# EAGLE design board_wifi_v1 (EAGLE 9.1.1)
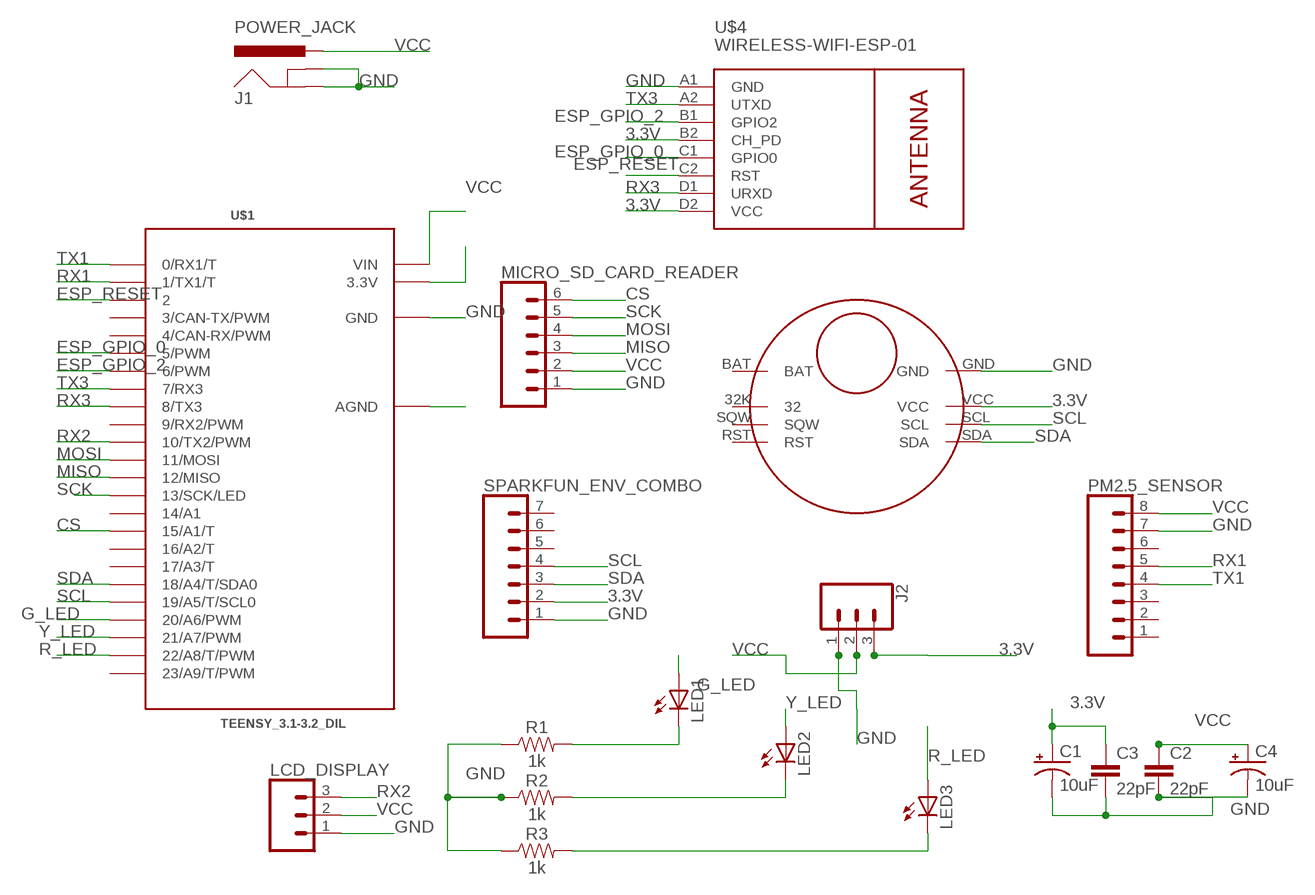
[diagram p0: schematic, sheet 1]

## Parts
C1  10uF  10UF-POLAR-RADIAL-2.5MM-25V-20%  [CPOL-RADIAL-2.5MM-5MM]
C2  22pF  22PF-PTH-2.54MM-200V-5%  [CAP-PTH-2.54]
C3  22pF  22PF-PTH-2.54MM-200V-5%  [CAP-PTH-2.54]
C4  10uF  10UF-POLAR-RADIAL-2.5MM-25V-20%  [CPOL-RADIAL-2.5MM-5MM]
J1  POWER_JACK  [POWER_JACK_PTH]
J2  CONN_03LONGPADS  [1X03_LONGPADS]
LCD_DISPLAY  CONN_031X03_NO_SILK  [1X03_NO_SILK]
LED1  LED3MM  [LED3MM]
LED2  LED3MM  [LED3MM]
LED3  LED3MM  [LED3MM]
MICRO_SD_CARD_READER  CONN_06LONGPADS  [1X06_LONGPADS]
PM2.5_SENSOR  CONN_08NO_SILK_FEMALE_PTH  [1X08_NO_SILK]
R1  1k  1KOHM-HORIZ-1/4W-5%  [AXIAL-0.3]
R2  1k  1KOHM-HORIZ-1/4W-5%  [AXIAL-0.3]
R3  1k  1KOHM-HORIZ-1/4W-5%  [AXIAL-0.3]
SPARKFUN_ENV_COMBO  CONN_07NO_SILK  [1X07_NO_SILK]
U$1  TEENSY_3.1-3.2_DIL  [TEENSY_3.0-3.2&LC_DIL]
U$2  RTCCLOCK  [RTCCLOCK]
U$4  WIRELESS-WIFI-ESP-01  [WIRELESS-WIFI-ESP-01]

## Nets
3.3V [3.3V]: C1.1(+) C3.1 J2.3 SPARKFUN_ENV_COMBO.2 U$2.VCC U$4.B2(CH_PD) U$4.D2(VCC)
CS: MICRO_SD_CARD_READER.6 U$1.15/A1(15/A1/T)
ESP_GPIO_0: U$1.5(5/PWM) U$4.C1(GPIO0)
ESP_GPIO_2: U$1.6(6/PWM) U$4.B1(GPIO2)
ESP_RESET: U$1.2 U$4.C2(RST)
G_LED: LED1.A U$1.20/A6(20/A6/PWM)
GND [Ground]: C1.2(-) C2.2 C3.2 C4.2(-) J1.GND J1.GNDBREAK J2.1 LCD_DISPLAY.1 MICRO_SD_CARD_READER.1 PM2.5_SENSOR.7 R1.P$1 R2.P$1 R3.P$1 SPARKFUN_ENV_COMBO.1 U$1.GND U$2.GND U$4.A1(GND)
MISO: MICRO_SD_CARD_READER.3 U$1.12(12/MISO)
MOSI: MICRO_SD_CARD_READER.4 U$1.11(11/MOSI)
N$1: U$1.3.3V
N$2: U$1.AGND
N$9: LED1.K(C) R1.P$2
N$10: LED2.K(C) R2.P$2
N$11: LED3.K(C) R3.P$2
R_LED: LED3.A U$1.22/A8(22/A8/T/PWM)
RX1: PM2.5_SENSOR.5 U$1.1(1/TX1/T)
RX2: LCD_DISPLAY.3 U$1.10(10/TX2/PWM)
RX3: U$1.8(8/TX3) U$4.D1(URXD)
SCK: MICRO_SD_CARD_READER.5 U$1.13(13/SCK/LED)
SCL: SPARKFUN_ENV_COMBO.4 U$1.19/A5(19/A5/T/SCL0) U$2.SCL
SDA: SPARKFUN_ENV_COMBO.3 U$1.18/A4(18/A4/T/SDA0) U$2.SDA
TX1: PM2.5_SENSOR.4 U$1.0(0/RX1/T)
TX3: U$1.7(7/RX3) U$4.A2(UTXD)
VCC [VCC]: C2.1 C4.1(+) J1.PWR J2.2 LCD_DISPLAY.2 MICRO_SD_CARD_READER.2 PM2.5_SENSOR.8 U$1.VIN
Y_LED: LED2.A U$1.21/A7(21/A7/PWM)
Unconnected: PM2.5_SENSOR.1 PM2.5_SENSOR.2 PM2.5_SENSOR.3 PM2.5_SENSOR.6 SPARKFUN_ENV_COMBO.5 SPARKFUN_ENV_COMBO.6 SPARKFUN_ENV_COMBO.7 U$1.3(3/CAN-TX/PWM) U$1.4(4/CAN-RX/PWM) U$1.9(9/RX2/PWM) U$1.14/A0(14/A1) U$1.16/A2(16/A2/T) U$1.17/A3(17/A3/T) U$1.23/A9(23/A9/T/PWM) U$2.32K U$2.BAT U$2.RST U$2.SQW

## Library data of the parts
C1 C4 = SparkFun-Capacitors:10UF-POLAR: 10.0µF polarized capacitors A capacitor is a passive two-terminal electrical component used to store electrical energy temporarily in an electric field.; PROD_ID: CAP-08440
C2 C3 = SparkFun-Capacitors:22PF: 22pF ceramic capacitors A capacitor is a passive two-terminal electrical component used to store electrical energy temporarily in an electric field.; PROD_ID: CAP-09128
J1 = SparkFun-Connectors:POWER_JACK: Power Jack Connector This is the standard 5.5mm barrel jack for power. The PTH is the most common, proven, reliable, footprint. The Slot footprint only works if the mill layer is transmitted to the PCB fab house so be warned. Here are the connectors we sell at SparkFun: DC Barrel Power Jack/Connector <https://www.sparkfun.com/products/119> (PRT-00119) DC Barrel Power Jack/Connector (SMD) <https://www.sparkfun.com/products/12748> (PRT-12748) DC Barrel Jack Adapter - Breadboard Compatible <https://www.sparkfun.com/products/10811> (PRT-10811) It is used on this SparkFun product (and many, many others): SparkFun RedBoard - Programmed with Arduino <https://www.sparkfun.com/products/12757> (DEV-12757) Also, if you need a mating power supply or connector, please check these out: Wall Adapter Power Supply - 9VDC 650mA <https://www.sparkfun.com/products/298> (TOL-00298) DC Barrel Jack Adapter - Male <https://www.sparkfun.com/products/10287> (PRT-10287); PROD_ID: CONN-08197
J2 LCD_DISPLAY = SparkFun-Connectors:CONN_03: Multi connection point. Often used as Generic Header-pin footprint for 0.1 inch spaced/style header connections On any of the 0.1 inch spaced packages, you can populate with these: Break Away Headers - Straight <https://www.sparkfun.com/products/116> (PRT-00116) Break Away Male Headers - Right Angle <https://www.sparkfun.com/products/553> (PRT-00553) Female Headers <https://www.sparkfun.com/products/115> (PRT-00115) Break Away Headers - Machine Pin <https://www.sparkfun.com/products/117> (PRT-00117) Break Away Female Headers - Swiss Machine Pin <https://www.sparkfun.com/products/743> (PRT-00743) Stackable Header - 3 Pin (Female, 0.1") <https://www.sparkfun.com/products/13875> (PRT-13875) For SCREWTERMINALS and SPRING TERMINALS visit here: Screw Terimnals on SparkFun.com <https://www.sparkfun.com/search/results?term=Screw+Terminals> (5mm/3.5mm/2.54mm spacing) This device is also useful as a general connection point to wire up your design to another part of your project. Our various solder wires solder well into these plated through hole pads. Hook-Up Wire - Assortment (Stranded, 22 AWG) <https://www.sparkfun.com/products/11375> (PRT-11375) Hook-Up Wire - Assortment (Solid Core, 22 AWG) <https://www.sparkfun.com/products/11367> (PRT-11367) View the entire wire category on our website here <https://www.sparkfun.com/categories/141> Special notes: Molex polarized connector foot print use with SKU : PRT-08232 with associated crimp pins and housings.
LED1-LED3 = led:LED: LED OSRAM: - CHIPLED LG R971, LG N971, LY N971, LG Q971, LY Q971, LO R971, LY R971 LH N974, LH R974 LS Q976, LO Q976, LY Q976 LO Q996 - Hyper CHIPLED LW Q18S LB Q993, LB Q99A, LB R99A - SideLED LS A670, LO A670, LY A670, LG A670, LP A670 LB A673, LV A673, LT A673, LW A673 LH A674 LY A675 LS A676, LA A676, LO A676, LY A676, LW A676 LS A679, LY A679, LG A679 - Hyper Micro SIDELED® LS Y876, LA Y876, LO Y876, LY Y876 LT Y87S - SmartLED LW L88C, LW L88S LB L89C, LB L89S, LG L890 LS L89K, LO L89K, LY L89K LS L896, LA L896, LO L896, LY L896 - TOPLED LS T670, LO T670, LY T670, LG T670, LP T670 LSG T670, LSP T670, LSY T670, LOP T670, LYG T670 LG T671, LOG T671, LSG T671 LB T673, LV T673, LT T673, LW T673 LH T674 LS T676, LA T676, LO T676, LY T676, LB T676, LH T676, LSB T676, LW T676 LB T67C, LV T67C, LT T67C, LS T67K, LO T67K, LY T67K, LW E67C LS E67B, LA E67B, LO E67B, LY E67B, LB E67C, LV E67C, LT E67C LW T67C LS T679, LY T679, LG T679 LS T770, LO T770, LY T770, LG T770, LP T770 LB T773, LV T773, LT T773, LW T773 LH T774 LS E675, LA E675, LY E675, LS T675 LS T776, LA T776, LO T776, LY T776, LB T776 LHGB T686 LT T68C, LB T68C - Hyper Mini TOPLED® LB M676 - Mini TOPLED Santana® LG M470 LS M47K, LO M47K, LY M47K Source: http://www.osram.convergy.de LUXEON: - LUMILED® LXK2-PW12-R00, LXK2-PW12-S00, LXK2-PW14-U00, LXK2-PW14-V00 LXK2-PM12-R00, LXK2-PM12-S00, LXK2-PM14-U00 LXK2-PE12-Q00, LXK2-PE12-R00, LXK2-PE12-S00, LXK2-PE14-T00, LXK2-PE14-U00 LXK2-PB12-K00, LXK2-PB12-L00, LXK2-PB12-M00, LXK2-PB14-N00, LXK2-PB14-P00, LXK2-PB14-Q00 LXK2-PR12-L00, LXK2-PR12-M00, LXK2-PR14-Q00, LXK2-PR14-R00 LXK2-PD12-Q00, LXK2-PD12-R00, LXK2-PD12-S00 LXK2-PH12-R00, LXK2-PH12-S00 LXK2-PL12-P00, LXK2-PL12-Q00, LXK2-PL12-R00 Source: www.luxeon.com KINGBRIGHT: KA-3528ASYC Source: www.kingbright.com
MICRO_SD_CARD_READER = SparkFun-Connectors:CONN_06: Multi connection point. Often used as Generic Header-pin footprint for 0.1 inch spaced/style header connections On any of the 0.1 inch spaced packages, you can populate with these: Break Away Headers - Straight <https://www.sparkfun.com/products/116> (PRT-00116) Break Away Male Headers - Right Angle <https://www.sparkfun.com/products/553> (PRT-00553) Female Headers <https://www.sparkfun.com/products/115> (PRT-00115) Break Away Headers - Machine Pin <https://www.sparkfun.com/products/117> (PRT-00117) Break Away Female Headers - Swiss Machine Pin <https://www.sparkfun.com/products/743> (PRT-00743) Arduino Stackable Header - 6 Pin <https://www.sparkfun.com/products/9280> (PRT-09280) For SCREWTERMINALS and SPRING TERMINALS visit here: Screw Terimnals on SparkFun.com <https://www.sparkfun.com/search/results?term=Screw+Terminals> (5mm/3.5mm/2.54mm spacing) This device is also useful as a general connection point to wire up your design to another part of your project. Our various solder wires solder well into these plated through hole pads. Hook-Up Wire - Assortment (Stranded, 22 AWG) <https://www.sparkfun.com/products/11375> (PRT-11375) Hook-Up Wire - Assortment (Solid Core, 22 AWG) <https://www.sparkfun.com/products/11367> (PRT-11367) View the entire wire category on our website here <https://www.sparkfun.com/categories/141>
PM2.5_SENSOR = SparkFun-Connectors:CONN_08: Multi connection point. Often used as Generic Header-pin footprint for 0.1 inch spaced/style header connections On any of the 0.1 inch spaced packages, you can populate with these: Break Away Headers - Straight <https://www.sparkfun.com/products/116> (PRT-00116) Break Away Male Headers - Right Angle <https://www.sparkfun.com/products/553> (PRT-00553) Female Headers <https://www.sparkfun.com/products/115> (PRT-00115) Break Away Headers - Machine Pin <https://www.sparkfun.com/products/117> (PRT-00117) Break Away Female Headers - Swiss Machine Pin <https://www.sparkfun.com/products/743> (PRT-00743) Arduino Stackable Header - 8 Pin <https://www.sparkfun.com/products/9279> (PRT-09279) For SCREWTERMINALS and SPRING TERMINALS visit here: Screw Terimnals on SparkFun.com <https://www.sparkfun.com/search/results?term=Screw+Terminals> (5mm/3.5mm/2.54mm spacing) This device is also useful as a general connection point to wire up your design to another part of your project. Our various solder wires solder well into these plated through hole pads. Hook-Up Wire - Assortment (Stranded, 22 AWG) <https://www.sparkfun.com/products/11375> (PRT-11375) Hook-Up Wire - Assortment (Solid Core, 22 AWG) <https://www.sparkfun.com/products/11367> (PRT-11367) View the entire wire category on our website here <https://www.sparkfun.com/categories/141> Special notes: Molex polarized connector foot print use with SKU : PRT-08231 with associated crimp pins and housings. 1MM SMD Version SKU: PRT-10208 NOTES ON THE VARIANTS LOCK and LOCK_LONGPADS... This footprint was designed to help hold the alignment of a through-hole component (i.e. 6-pin header) while soldering it into place. You may notice that each hole has been shifted either up or down by 0.005 of an inch from it's more standard position (which is a perfectly straight line). This slight alteration caused the pins (the squares in the middle) to touch the edges of the holes. Because they are alternating, it causes a "brace" to hold the component in place. 0.005 has proven to be the perfect amount of "off-center" position when using our standard breakaway headers. Although looks a little odd when you look at the bare footprint, once you have a header in there, the alteration is very hard to notice. Also,if you push a header all the way into place, it is covered up entirely on the bottom side.; PROD_ID: CONN-08438
R1-R3 = SparkFun-Resistors:1KOHM: 1kΩ resistor A resistor is a passive two-terminal electrical component that implements electrical resistance as a circuit element. Resistors act to reduce current flow, and, at the same time, act to lower voltage levels within circuits. - Wikipedia; PROD_ID: RES-08380
SPARKFUN_ENV_COMBO = SparkFun-Connectors:CONN_07: Multi connection point. Often used as Generic Header-pin footprint for 0.1 inch spaced/style header connections On any of the 0.1 inch spaced packages, you can populate with these: Break Away Headers - Straight <https://www.sparkfun.com/products/116> (PRT-00116) Break Away Male Headers - Right Angle <https://www.sparkfun.com/products/553> (PRT-00553) Female Headers <https://www.sparkfun.com/products/115> (PRT-00115) Break Away Headers - Machine Pin <https://www.sparkfun.com/products/117> (PRT-00117) Break Away Female Headers - Swiss Machine Pin <https://www.sparkfun.com/products/743> (PRT-00743) For SCREWTERMINALS and SPRING TERMINALS visit here: Screw Terimnals on SparkFun.com <https://www.sparkfun.com/search/results?term=Screw+Terminals> (5mm/3.5mm/2.54mm spacing) This device is also useful as a general connection point to wire up your design to another part of your project. Our various solder wires solder well into these plated through hole pads. Hook-Up Wire - Assortment (Stranded, 22 AWG) <https://www.sparkfun.com/products/11375> (PRT-11375) Hook-Up Wire - Assortment (Solid Core, 22 AWG) <https://www.sparkfun.com/products/11367> (PRT-11367) View the entire wire category on our website here <https://www.sparkfun.com/categories/141> Special notes: Molex polarized connector foot print use with SKU : PRT-08231 with associated crimp pins and housings. 1MM SMD Version SKU: PRT-10208 NOTES ON THE VARIANTS LOCK and LOCK_LONGPADS... This footprint was designed to help hold the alignment of a through-hole component (i.e. 6-pin header) while soldering it into place. You may notice that each hole has been shifted either up or down by 0.005 of an inch from it's more standard position (which is a perfectly straight line). This slight alteration caused the pins (the squares in the middle) to touch the edges of the holes. Because they are alternating, it causes a "brace" to hold the component in place. 0.005 has proven to be the perfect amount of "off-center" position when using our standard breakaway headers. Although looks a little odd when you look at the bare footprint, once you have a header in there, the alteration is very hard to notice. Also,if you push a header all the way into place, it is covered up entirely on the bottom side.
U$1 = Teensy_3_and_LC_Series_Boards_v1.4:TEENSY_3.1-3.2_DIL: Teensy 3.1 or 3.2 in a DIL Layout.
U$2 = RTCDS3231:RTCCLOCK
U$4 = diy-modules:WIRELESS-WIFI-ESP-01: Wireless Wi-Fi ESP-01 Module based on ESP8266 chip Click here to find device on ebay.com <http://www.ebay.com/sch/esp8266+esp+01+transceiver>

## Net classes
0 signal: width 0.178 mm, clearance 0.203 mm
1 VCC: width 0.635 mm, clearance 0.203 mm
2 Ground: width 0.635 mm, clearance 0.203 mm
3 3.3V: width 0.381 mm, clearance 0.203 mm

## Board
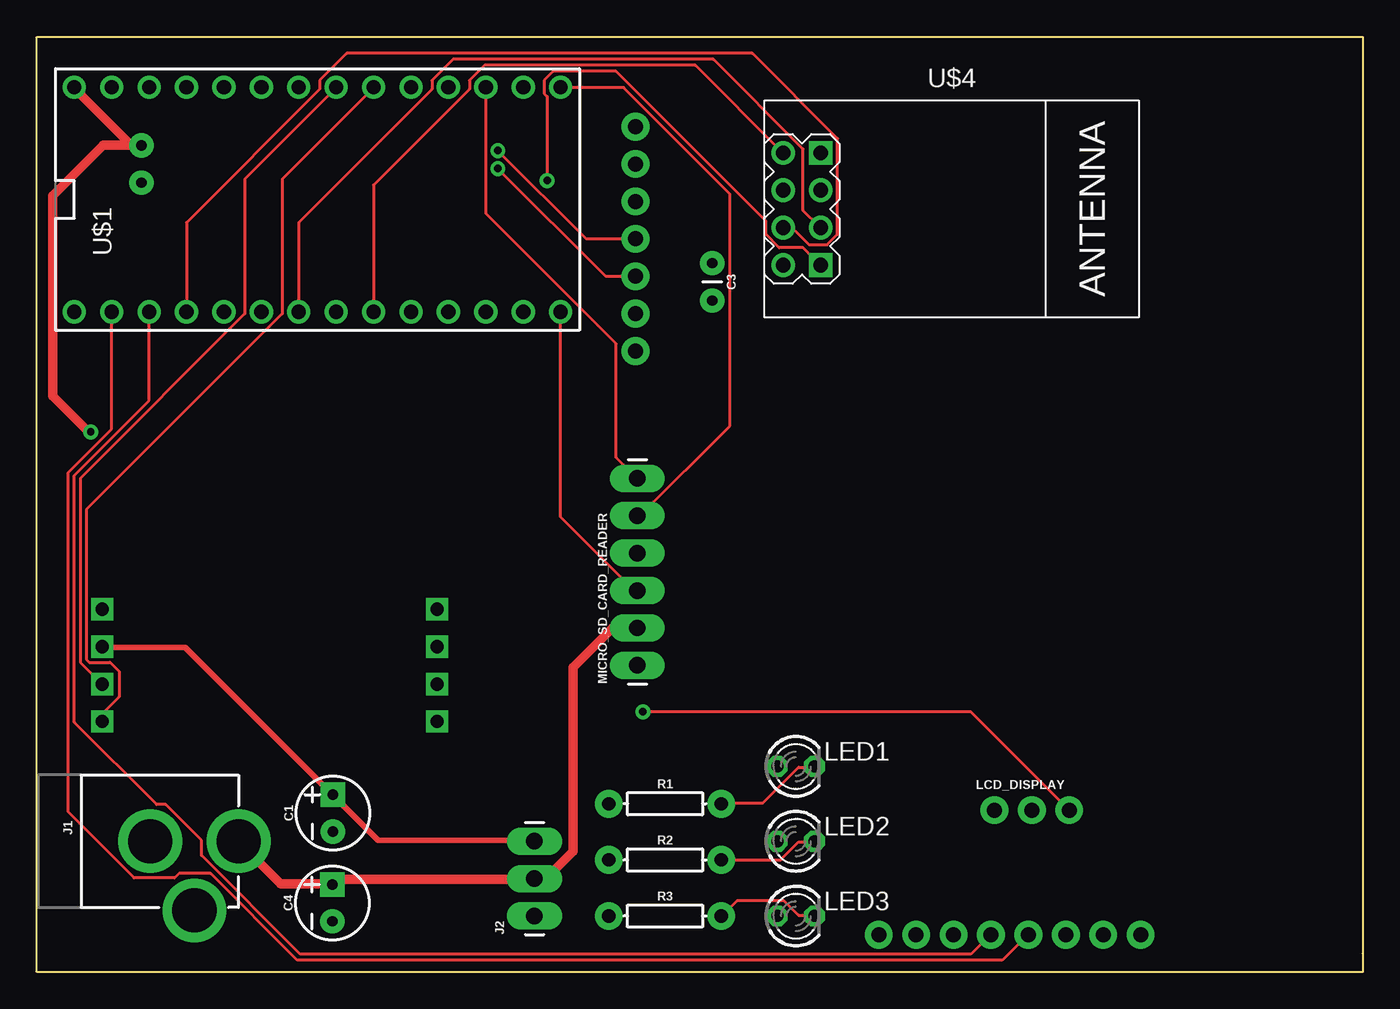
[diagram p1: board, top side]
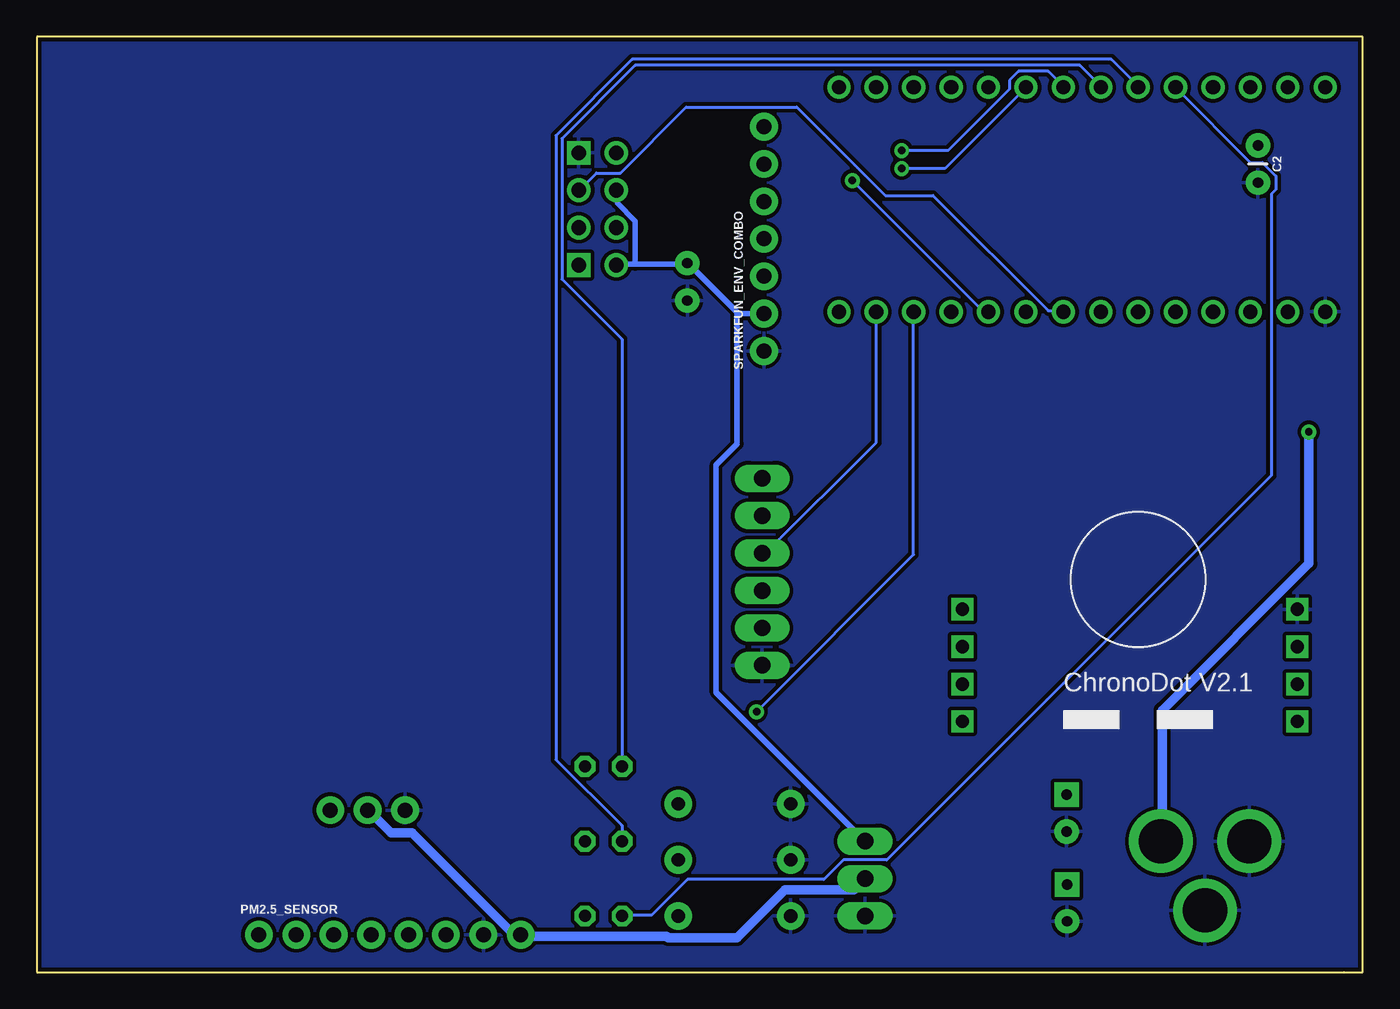
[diagram p2: board, bottom side, seen from below]

Size 90 x 63.5 mm. Coordinates in mm from the lower left corner, seen from the top.
Outline: 0,0 1.27,0
Outline: 1.27,0 90,0
Outline: 90,0 90,1.27 90,63.5 0,63.5 0,0
Outline: 90,0 1.27,0
Outline: 1.27,0 0,0
Copper layers (1*16): Top 0.035mm / dielectric 1.5mm / Bottom 0.035mm
Design rules "SparkFun": minimum track width 8mil, minimum drill 20mil, track to track 8mil, track to pad 8mil, pad to pad 8mil, via to via 8mil, smd to smd 8mil, copper to edge 8mil, drill to drill 8mil, minimum pad ring 12mil, minimum via ring 10mil, stop-mask expansion 4mil, vias tented up to drill 30mil, thermal gap 10mil

### Footprints (pad centres in the part's own frame; a part is rotated, then mirrored left to right if it is on the bottom)
CPOL-RADIAL-2.5MM-5MM = drill 0.7 pad 1.651 square: 1 1.25,0 | drill 0.7 pad 1.651: 2 -1.25,0
CAP-PTH-2.54 = drill 0.7 pad 1.651: 1 -1.27,0; 2 1.27,0
POWER_JACK_PTH = drill 2.997 pad 4.318: GND 0,7.7; GNDBREAK 4.7,10.7; PWR 0,13.7
1X03_LONGPADS = drill 1.118 pad 1.88 long: 1 0,0; 2 2.54,0; 3 5.08,0
1X03_NO_SILK = drill 1.016 pad 1.88: 1 0,0; 2 2.54,0; 3 5.08,0
LED3MM = drill 0.813 octagon: A -1.27,0; K 1.27,0
1X06_LONGPADS = drill 1.118 pad 1.88 long: 1 0,0; 2 2.54,0; 3 5.08,0; 4 7.62,0; 5 10.16,0; 6 12.7,0
1X08_NO_SILK = drill 1.016 pad 1.88: 1 0,0; 2 2.54,0; 3 5.08,0; 4 7.62,0; 5 10.16,0; 6 12.7,0; 7 15.24,0; 8 17.78,0
AXIAL-0.3 = drill 0.9 pad 1.88: P$1 -3.81,0; P$2 3.81,0
1X07_NO_SILK = drill 1.016 pad 1.88: 1 0,0; 2 2.54,0; 3 5.08,0; 4 7.62,0; 5 10.16,0; 6 12.7,0; 7 15.24,0
TEENSY_3.0-3.2&LC_DIL = drill 0.965: 0 -7.62,13.97; 1 -7.62,11.43; 2 -7.62,8.89; 3 -7.62,6.35; 3.3V 7.62,11.43; 4 -7.62,3.81; 5 -7.62,1.27; 6 -7.62,-1.27; 7 -7.62,-3.81; 8 -7.62,-6.35; 9 -7.62,-8.89; 10 -7.62,-11.43; 11 -7.62,-13.97; 12 -7.62,-16.51; 13 7.62,-16.51; 14/A0 7.62,-13.97; 15/A1 7.62,-11.43; 16/A2 7.62,-8.89; 17/A3 7.62,-6.35; 18/A4 7.62,-3.81; 19/A5 7.62,-1.27; 20/A6 7.62,1.27; 21/A7 7.62,3.81; 22/A8 7.62,6.35; 23/A9 7.62,8.89; AGND 7.62,13.97; GND -7.62,16.51; VIN 7.62,16.51
RTCCLOCK = drill 0.9 square: 32K -11.938,0.508; BAT -11.938,3.048; GND 10.795,3.048; RST -11.938,-4.572; SCL 10.795,-2.032; SDA 10.795,-4.572; SQW -11.938,-2.032; VCC 10.795,0.508
WIRELESS-WIFI-ESP-01 = drill 1 square: A1 -8.89,3.81; D1 -8.89,-3.81 | drill 1: A2 -11.43,3.81; B1 -8.89,1.27; B2 -11.43,1.27; C1 -8.89,-1.27; C2 -11.43,-1.27; D2 -11.43,-3.81

### Placement (x,y rotation side)
C1  20.1,10.79 90 top
C2  7.11,54.86 270 bottom
C3  45.85,46.86 270 top
C4  20.07,4.7 90 top
J1  0,8.89 270 top
J2  33.78,3.81 90 top
LCD_DISPLAY  65,11 0 top
LED1  51.53,13.97 0 top
LED2  51.53,8.89 0 top
LED3  51.53,3.81 0 top
MICRO_SD_CARD_READER  40.77,20.83 90 top
PM2.5_SENSOR  74.93,2.54 0 bottom
R1  42.64,11.43 0 top
R2  42.64,7.62 0 top
R3  42.64,3.81 0 top
SPARKFUN_ENV_COMBO  40.64,42.16 90 bottom
U$1  19.05,52.45 90 top
U$2  15.24,21.59 0 bottom
U$4  62.1,51.82 0 top

### Tracks (layer width: path | path; a pad name or v marks a point on that pad's centre or on a via)
3.3V
  Top 0.381: U$2.VCC 4.47,22.05 10.06,22.05 20.02,12.09 C1.1 20.22,11.89 23.16,8.94 33.73,8.94 J2.3
  Bottom 0.381: 49.38,48.06 45.92,48.06 C3.1 45.72,48.06 42.37,44.7 | 49.38,48.06 50.6,48.06 U$4.D2 | 49.38,48.06 49.38,51 50.6,52.22 50.6,53.03 U$4.B2 | 42.37,44.7 SPARKFUN_ENV_COMBO.2 | J2.3 43.89,19 43.89,34.44 42.47,35.87 42.47,44.6 42.37,44.7
CS
  Top 0.203: U$1.15/A1 30.48,51.51 39.32,42.67 39.32,34.95 40.74,33.53 MICRO_SD_CARD_READER.6
ESP_GPIO_0
  Top 0.203: U$1.5 17.78,50.9 26.82,59.94 26.82,60.55 28.25,61.98 45.92,61.98 52.02,55.88 52.02,51.71 53.14,50.6 U$4.C1
ESP_GPIO_2
  Bottom 0.203: U$1.6 20.32,44.91 21.34,44.91 29.16,52.73 32.41,52.73 38.41,58.73 45.92,58.73 50.39,54.25 52.02,54.25 53.14,53.14 U$4.B1
ESP_RESET
  Top 0.203: U$1.2 10.16,50.9 19.2,59.94 19.2,60.55 21.03,62.38 48.56,62.38 54.36,56.59 54.36,50.09 53.65,49.38 52.43,49.38 51.31,50.49 50.7,50.49 U$4.C2
G_LED
  Bottom 0.203: LED1.A 50.29,14.02 50.29,42.98 54.36,47.04 54.36,56.59 49.38,61.57 19.2,61.57 17.78,60.15 U$1.20/A6
GND
  pour Bottom (isolate 0.254): 0.25,0.25 89.66,0.25 89.79,0.38 89.79,63.25 89.66,63.37 0.38,63.37 0.25,63.25
MISO
  Top 0.203: U$1.12 35.56,30.89 40.54,25.91 MICRO_SD_CARD_READER.3
MOSI
  Bottom 0.203: U$1.11 33.02,35.97 40.54,28.45 MICRO_SD_CARD_READER.4
N$9
  Top 0.203: LED1.K 52.73,13.92 51.71,13.92 49.28,11.48 46.53,11.48 R1.P$2
N$10
  Top 0.203: R2.P$2 50.49,7.62 51.71,8.84 52.73,8.84 LED2.K
N$11
  Top 0.203: LED3.K 52.73,3.86 51.71,3.86 50.7,4.88 47.55,4.88 46.53,3.86 R3.P$2
R_LED
  Bottom 0.203: LED3.A 50.19,3.86 48.26,3.86 45.82,6.3 36.58,6.3 35.26,7.62 32.31,7.62 6.2,33.73 6.2,52.83 5.89,53.14 5.89,54.05 6.81,54.97 7.62,54.97 12.7,60.05 U$1.22/A8
RX1
  Top 0.203: U$1.1 7.62,38.81 2.54,33.73 2.54,16.97 8.13,11.38 8.74,11.38 11.18,8.94 11.18,7.92 17.88,1.22 63.4,1.22 64.72,2.54 PM2.5_SENSOR.5
RX2  (via drill 0.51)
  Top 0.203: v41.15,17.68 63.4,17.68 70,11.07 LCD_DISPLAY.3
  Bottom 0.203: U$1.10 30.48,28.35 v41.15,17.68
RX3  (via drill 0.51)
  Top 0.203: v34.65,53.75 34.65,59.44 34.44,59.64 34.44,60.55 35.05,61.16 39.32,61.16 49.48,51 49.48,50.09 50.39,49.17 52.02,49.17 53.14,48.06 U$4.D1
  Bottom 0.203: v34.65,53.75 25.81,44.91 25.4,44.91 U$1.8
SCK
  Top 0.203: MICRO_SD_CARD_READER.5 40.95,30.99 47.04,37.08 47.04,52.83 39.83,60.05 35.56,60.05 U$1.13
SCL  (via drill 0.51)
  Top 0.203: U$2.SCL 4.37,19.61 2.95,21.03 2.95,33.53 14.12,44.7 14.12,53.85 20.32,60.05 U$1.19/A5 | SPARKFUN_ENV_COMBO.4 37.29,49.78 v31.29,55.78
  Bottom 0.203: v31.29,55.78 28.14,55.78 23.98,59.94 23.98,60.55 23.37,61.16 21.34,61.16 20.32,60.15 U$1.19/A5
SDA  (via drill 0.51)
  Top 0.203: U$2.SDA 4.47,17.07 4.47,17.58 5.59,18.69 5.59,20.42 4.98,21.03 3.56,21.03 3.35,21.23 3.35,31.39 16.66,44.7 16.66,53.85 22.86,60.05 U$1.18/A4 | SPARKFUN_ENV_COMBO.3 38.61,47.24 v31.29,54.56
  Bottom 0.203: v31.29,54.56 28.35,54.56 22.86,60.05 U$1.18/A4
TX1
  Top 0.203: U$1.0 5.08,36.88 2.13,33.93 2.13,10.87 6.6,6.4 9.35,6.4 9.65,6.71 11.79,6.71 17.68,0.81 65.53,0.81 67.26,2.54 PM2.5_SENSOR.4
TX3
  Top 0.203: U$1.7 22.86,53.44 29.36,59.94 29.36,60.55 30.38,61.57 44.7,61.57 50.6,55.68 U$4.A2
VCC  (via drill 0.51)
  Top 0.635: U$1.VIN 2.54,59.99 6.4,56.13 C2.1 4.5,56.13 1.09,52.73 1.09,39.12 3.53,36.68 v3.66,36.68 | J1.PWR 13.72,8.84 16.56,5.99 20.02,5.99 C4.1 20.32,6.1 20.52,6.3 33.73,6.3 J2.2 34.04,6.5 34.7,6.5 36.4,8.2 36.4,20.68 39.09,23.37 MICRO_SD_CARD_READER.2
  Bottom 0.635: LCD_DISPLAY.2 67.46,10.97 65.94,9.45 64.52,9.45 57.61,2.54 PM2.5_SENSOR.8 56.9,2.44 47.24,2.44 47.14,2.34 42.47,2.34 39.22,5.59 34.54,5.59 J2.2 | v3.66,36.68 3.66,27.74 13.61,17.78 13.61,8.94 J1.PWR
Y_LED
  Bottom 0.203: LED2.A 50.29,8.94 50.29,9.96 54.76,14.43 54.76,56.79 49.58,61.98 17.07,61.98 15.24,60.15 U$1.21/A7